# EAGLE schematic Zero_V1.0 (EAGLE 7.7.0)

## Sheet 1 of 3
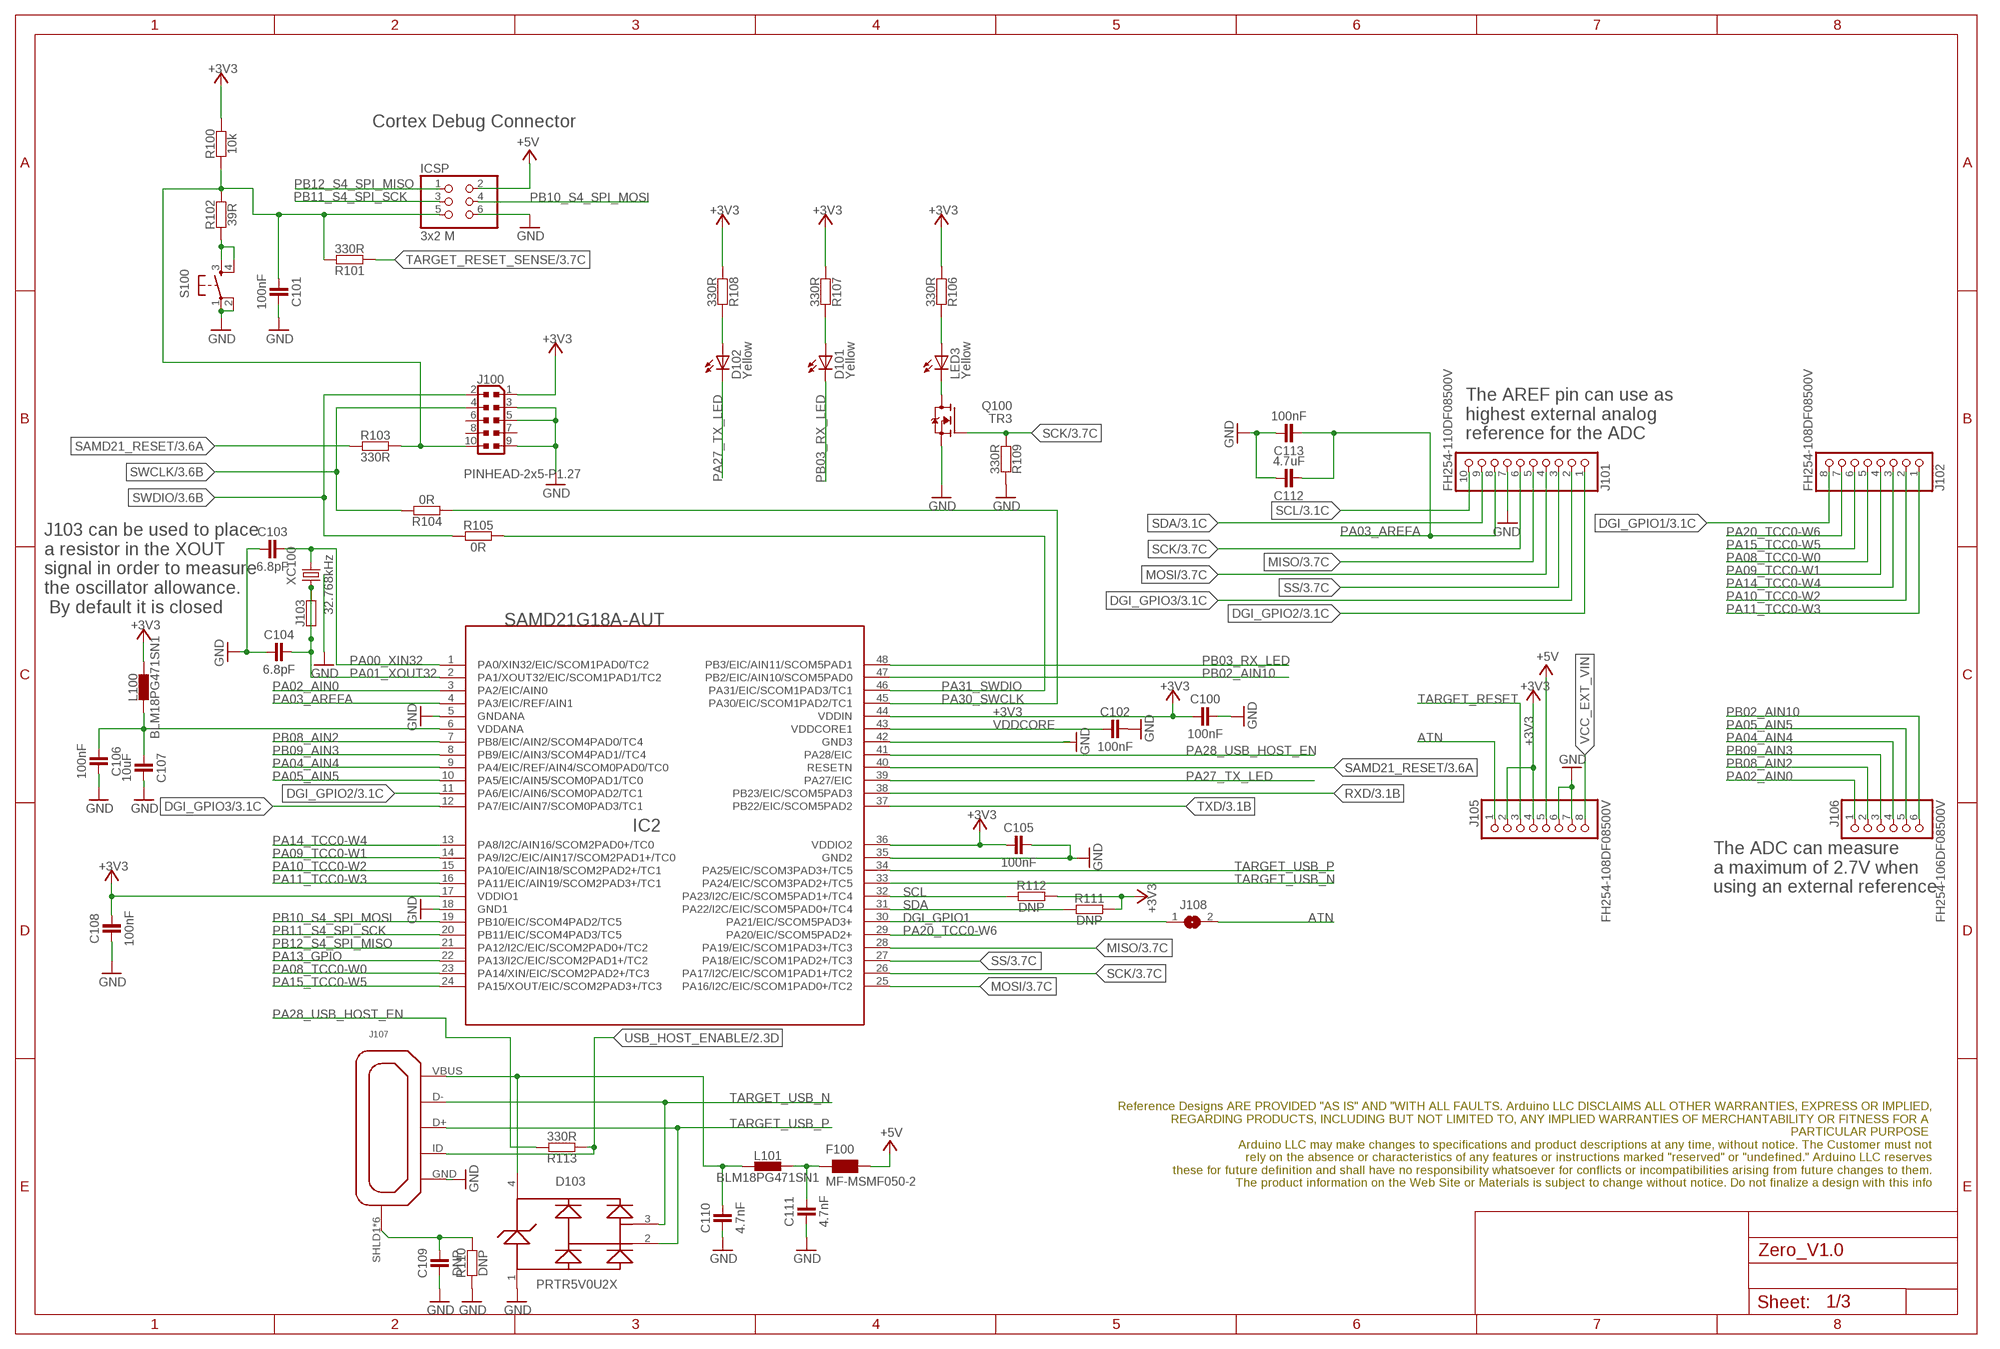
[diagram p0: schematic, sheet 1]

### Parts
C100  100nF  CAPACITORS-0402  [C0402]
C101  100nF  CAPACITORS-0402  [C0402]
C102  100nF  CAPACITORS-0402  [C0402]
C103  6.8pF  CAPACITORS-0402  [C0402]
C104  6.8pF  CAPACITORS-0402  [C0402]
C105  100nF  CAPACITORS-0402  [C0402]
C106  100nF  CAPACITORS-0402  [C0402]
C107  10uF  CAPACITORS-0603  [C0603]
C108  100nF  CAPACITORS-0402  [C0402]
C109  DNP  CAPACITORS-0402  [C0402]
C110  4.7nF  CAPACITORS-0402  [C0402]
C111  4.7nF  CAPACITORS-0402  [C0402]
C112  4.7uF  CAPACITORS-0603  [C0603]
C113  100nF  CAPACITORS-0402  [C0402]
D101  Yellow  0044_KPT-2012YC  [CHIPLED_0805]
D102  Yellow  0044_KPT-2012YC  [CHIPLED_0805]
D103  PRTR5V0U2XB  [SOT143B]
F100  MF-MSMF050-2  WUERTH-ELEKTRONIK_WE-CBF_1812  [WUERTH-ELEKTRONIK_1812]
IC2  SAMD21G18A-AUT  SAMD21G18A  [TQFP48]
ICSP  3x2 M  ICSP  [2X03]
J100  PINHEAD-2x5-P1.27  0171_PH127-205DF055G00AROUND-PADS  [PINHEAD_2X05_127]
J101  FH254-110DF08500V  1684_20TW-537  [1X10]
J102  FH254-108DF08500V  1683_20TW-536  [1X08]
J103  RESISTORS-0402  [C0402]
J105  FH254-108DF08500V  1683_20TW-536  [1X08]
J106  FH254-106DF08500V  1682_20TW-535_STD  [1X06]
J107  ZX62-AB-5PA  [USB-MICRO-10103594]
J108  SJ  [SJ]
L100  BLM18PG471SN1  INDUCTOR-0603  [C0603]
L101  BLM18PG471SN1  INDUCTOR-0603  [C0603]
LED3  Yellow  0044_KPT-2012YC  [CHIPLED_0805]
R100  10k  RESISTORS-0402  [C0402]
R101  330R  RESISTORS-0402  [C0402]
R102  39R  RESISTORS-0402  [C0402]
R103  330R  RESISTORS-0402  [C0402]
R104  0R  RESISTORS-0402  [C0402]
R105  0R  RESISTORS-0402  [C0402]
R106  330R  RESISTORS-0402  [C0402]
R107  330R  RESISTORS-0402  [C0402]
R108  330R  RESISTORS-0402  [C0402]
R109  330R  RESISTORS-0402  [C0402]
R110  DNP  RESISTORS-0402  [C0402]
R111  DNP  RESISTORS-0402  [C0402]
R112  DNP  RESISTORS-0402  [C0402]
R113  330R  RESISTORS-0402  [C0402]
S100  PUSHBUTTON3  [TS42_4PINS]
TR3  Q100  1612_2N7002LT1G  [SOT-23]
U$5  DNP  A3-FRAME-STANDARD  [FRAME]
XC100  32.768kHz  CRYSTALSMD  [CRYSTAL_TC26SMD]

### Nets
+3V3: C100.1 C105.1 C108.2 IC2.17(VDDIO1) IC2.36(VDDIO2) IC2.44(VDDIN) J100.1 J105.2 J105.4 L100.2 R100.2 R106.1 R107.1 R108.1 R111.2 R112.2 ; also sheet 2,3
+5V [usbvcc]: F100.2 ICSP.2 J105.5 ; also sheet 2
ATN: J105.1 J108.2
DGI_GPIO1: IC2.30(PA21/EIC/SCOM5PAD3+) J102.8 J108.1 ; also sheet 3
DGI_GPIO2: IC2.11(PA6/EIC/AIN6/SCOM0PAD2/TC1) J101.1 ; also sheet 3
DGI_GPIO3: IC2.12(PA7/EIC/AIN7/SCOM0PAD3/TC1) J101.2 ; also sheet 3
GND [gnd]: C100.2 C101.2 C102.2 C103.1 C104.1 C105.2 C106.2 C107.2 C108.1 C109.1 C110.1 C111.1 C112.2 C113.2 D103.1 IC2.5(GNDANA) IC2.18(GND1) IC2.35(GND2) IC2.42(GND3) ICSP.6 J100.3 J100.5 J100.9 J101.7 J105.6 J105.7 J107.GND R109.2 R110.1 S100.1 S100.2 TR3.2(S) XC100.P$1(GND) ; also sheet 2,3
MISO: IC2.28(PA19/EIC/SCOM1PAD3+/TC3) J101.5 ; also sheet 3
MOSI: IC2.25(PA16/I2C/EIC/SCOM1PAD0+/TC2) J101.4 ; also sheet 3
N$3: LED3.C TR3.1(D)
N$4: R102.1 S100.3 S100.4
N$7: C110.2 D103.4 J107.VBUS(VUSB) L101.1
N$10: C106.1 C107.1 IC2.6(VDDANA) L100.1
N$11: C109.2 J107.SHLD1(SH) J107.SHLD2(SH) J107.SHLD3(SH) J107.SHLD4(SH) J107.SHLD5(SH) J107.SHLD6(SH) R110.2
N$12: C111.2 F100.1 L101.2
N$20: D102.A R108.2
N$21: D101.A R107.2
N$22: LED3.A R106.2
PA00_XIN32: C103.2 IC2.1(PA0/XIN32/EIC/SCOM1PAD0/TC2) XC100.2
PA01_XOUT32: C104.2 IC2.2(PA1/XOUT32/EIC/SCOM1PAD1/TC2) J103.1 J103.2 XC100.1
PA02_AIN0: IC2.3(PA2/EIC/AIN0) J106.1
PA03_AREFA: C112.1 C113.1 IC2.4(PA3/EIC/REF/AIN1) J101.8
PA04_AIN4: IC2.9(PA4/EIC/REF/AIN4/SCOM0PAD0/TC0) J106.4
PA05_AIN5: IC2.10(PA5/EIC/AIN5/SCOM0PAD1/TC0) J106.5
PA08_TCC0-W0: IC2.23(PA14/XIN/EIC/SCOM2PAD2+/TC3) J102.5
PA09_TCC0-W1: IC2.14(PA9/I2C/EIC/AIN17/SCOM2PAD1+/TC0) J102.4
PA10_TCC0-W2: IC2.15(PA10/EIC/AIN18/SCOM2PAD2+/TC1) J102.2
PA11_TCC0-W3: IC2.16(PA11/EIC/AIN19/SCOM2PAD3+/TC1) J102.1
PA13_GPIO: IC2.22(PA13/I2C/EIC/SCOM2PAD1+/TC2)
PA14_TCC0-W4: IC2.13(PA8/I2C/AIN16/SCOM2PAD0+/TC0) J102.3
PA15_TCC0-W5: IC2.24(PA15/XOUT/EIC/SCOM2PAD3+/TC3) J102.6
PA20_TCC0-W6: IC2.29(PA20/EIC/SCOM5PAD2+) J102.7
PA27_TX_LED: D102.C IC2.39(PA27/EIC)
PA28_USB_HOST_EN: IC2.41(PA28/EIC) R113.2
PA30_SWCLK: IC2.45(PA30/EIC/SCOM1PAD2/TC1) R104.1
PA31_SWDIO: IC2.46(PA31/EIC/SCOM1PAD3/TC1) R105.2
PB02_AIN10: IC2.47(PB2/EIC/AIN10/SCOM5PAD0) J106.6
PB03_RX_LED: D101.C IC2.48(PB3/EIC/AIN11/SCOM5PAD1)
PB08_AIN2: IC2.7(PB8/EIC/AIN2/SCOM4PAD0/TC4) J106.2
PB09_AIN3: IC2.8(PB9/EIC/AIN3/SCOM4PAD1//TC4) J106.3
PB10_S4_SPI_MOSI: IC2.19(PB10/EIC/SCOM4PAD2/TC5) ICSP.4
PB11_S4_SPI_SCK: IC2.20(PB11/EIC/SCOM4PAD3/TC5) ICSP.3
PB12_S4_SPI_MISO: IC2.21(PA12/I2C/EIC/SCOM2PAD0+/TC2) ICSP.1
RXD: IC2.38(PB23/EIC/SCOM5PAD3) ; also sheet 3
SAMD21_RESET: IC2.40(RESETN) R103.1 ; also sheet 3
SCK: IC2.26(PA17/I2C/EIC/SCOM1PAD1+/TC2) J101.6 R109.1 TR3.3(G) ; also sheet 3
SCL: IC2.32(PA23/I2C/EIC/SCOM5PAD1+/TC4) J101.10 R112.1 ; also sheet 3
SDA: IC2.31(PA22/I2C/EIC/SCOM5PAD0+/TC4) J101.9 R111.1 ; also sheet 3
SS: IC2.27(PA18/EIC/SCOM1PAD2+/TC3) J101.3 ; also sheet 3
SWCLK: J100.4 R104.2 ; also sheet 3
SWDIO: J100.2 R105.1 ; also sheet 3
TARGET_RESET: C101.1 ICSP.5 J100.10 J105.3 R100.1 R101.2 R102.2 R103.2
TARGET_RESET_SENSE: R101.1 ; also sheet 3
TARGET_USB_N [USBpair]: D103.3 IC2.33(PA24/EIC/SCOM3PAD2+/TC5) J107.D-
TARGET_USB_P [USBpair]: D103.2 IC2.34(PA25/EIC/SCOM3PAD3+/TC5) J107.D+
TXD: IC2.37(PB22/EIC/SCOM5PAD2) ; also sheet 3
USB_HOST_ENABLE: J107.ID R113.1 ; also sheet 2
VCC_EXT_VIN [USB]: J105.8 ; also sheet 2
VDDCORE: C102.1 IC2.43(VDDCORE1)
Unconnected: J100.6 J100.7 J100.8

### Notes on the sheet
- Cortex Debug Connector
- The AREF pin can use as
  highest external analog
  reference for the ADC
- J103 can be used to place
  a resistor in the XOUT 
  signal in order to measure 
  the oscillator allowance.
   By default it is closed
- The ADC can measure 
  a maximum of 2.7V when
  using an external reference

## Sheet 2 of 3
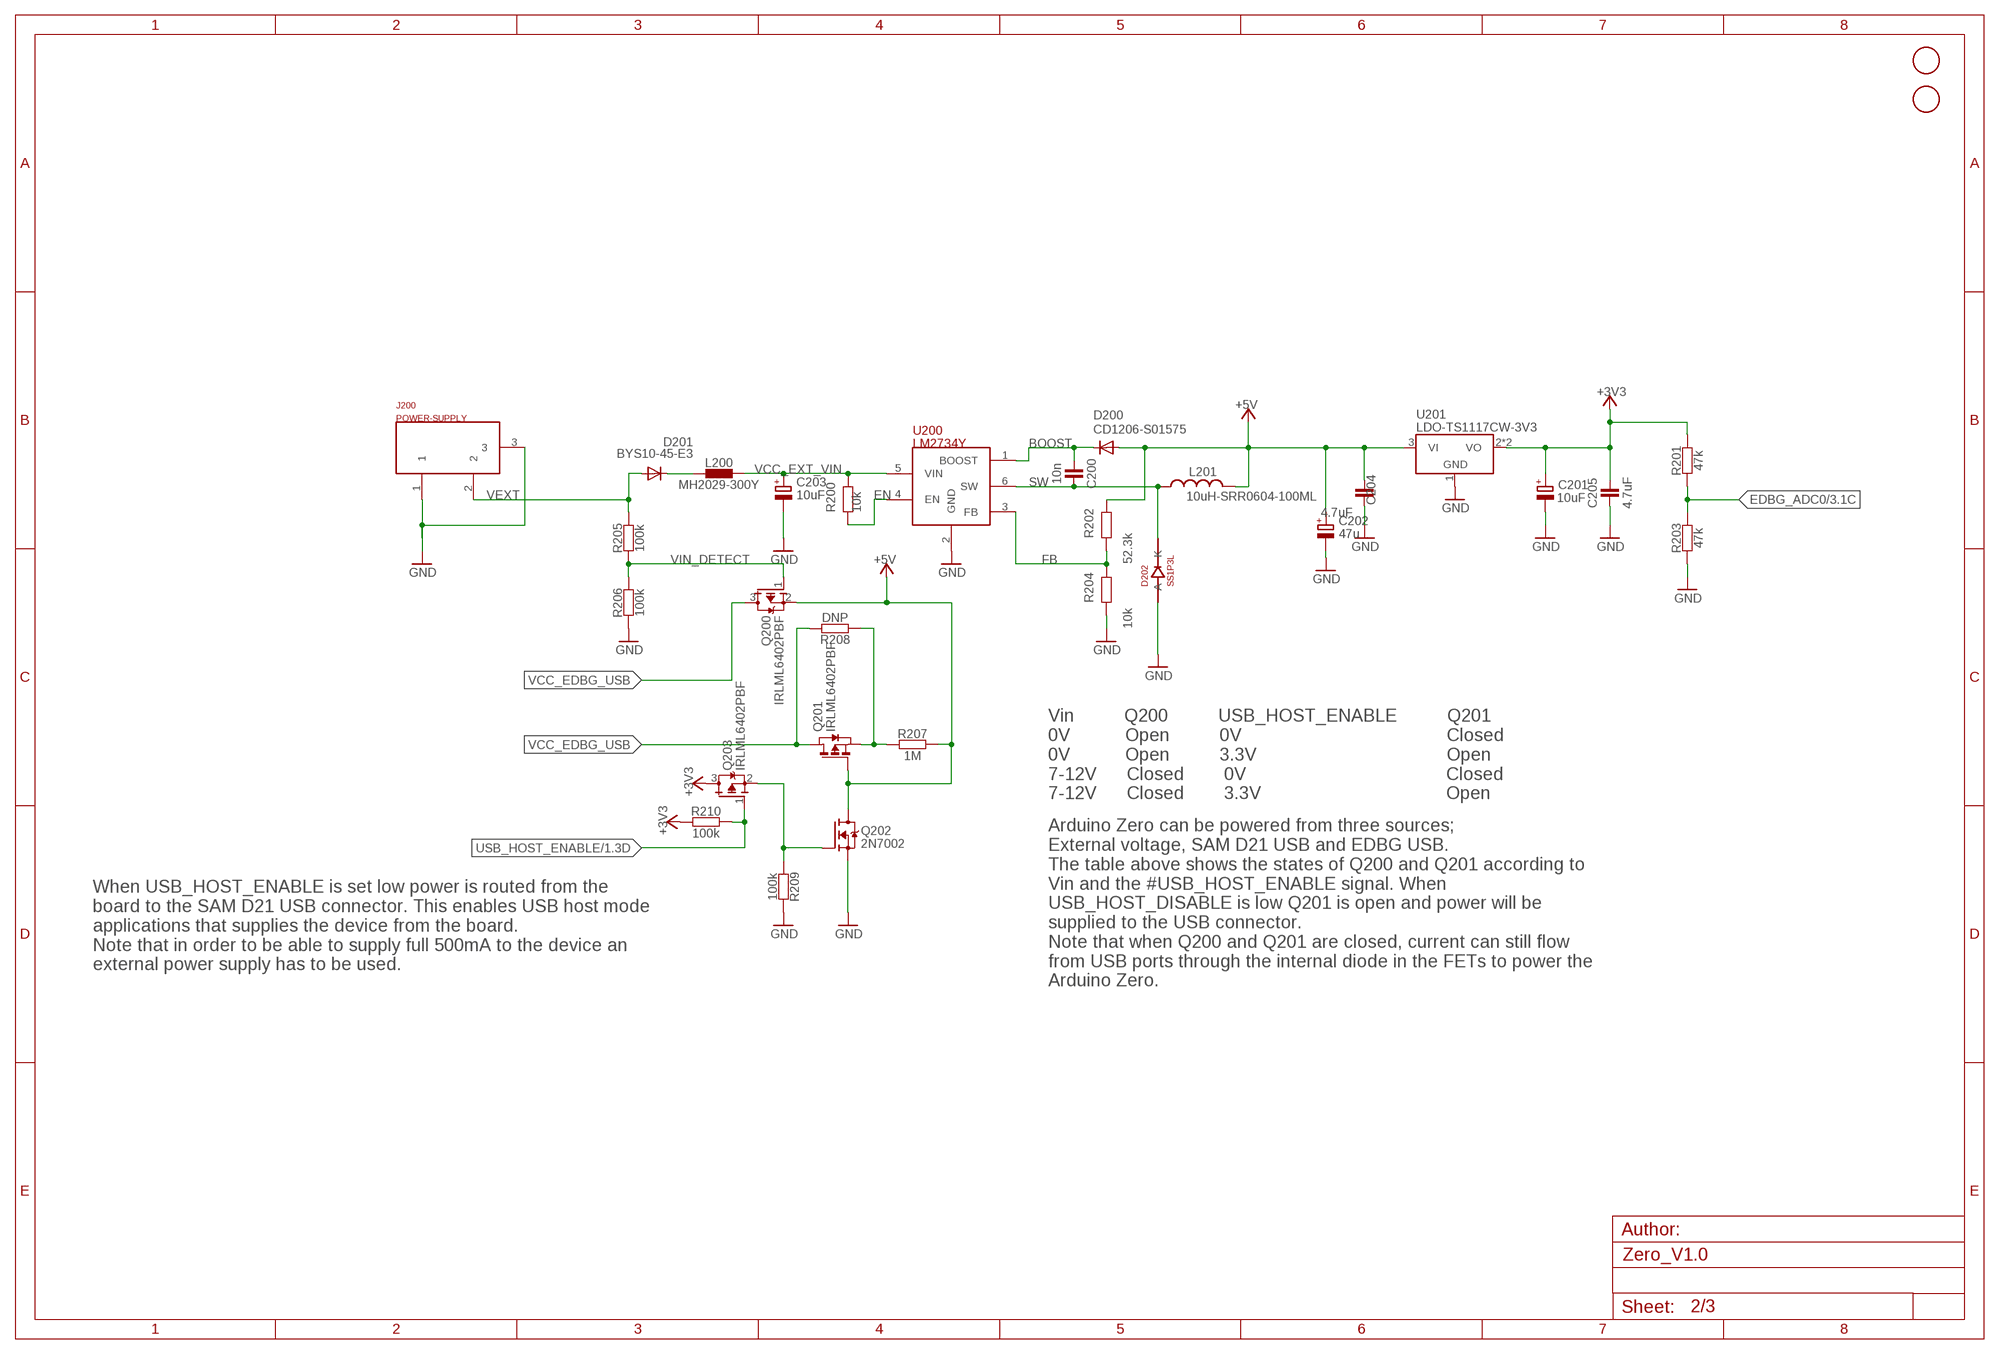
[diagram p1: schematic, sheet 2]

### Parts
C200  10n  CAPACITORS-0402  [C0402]
C201  10uF  0113_47UF  [PANASONIC_D]
C202  47u  0113_47UF  [PANASONIC_D]
C203  10uF  0113_47UF  [PANASONIC_D]
C204  4.7uF  CAPACITORS-0603  [C0603]
C205  4.7uF  CAPACITORS-0603  [C0603]
D200  CD1206-S01575  0012_CD1206-S01575  [MINIMELF]
D201  BYS10-45-E3  0012_CD1206-S01575  [MINIMELF]
D202  SS1P3L  0025_SS1P3L-M3/84A  [DO220AAL]
FD1  FIDUCIALMOUNT  [FIDUCIA-MOUNT]
FD2  FIDUCIALMOUNT  [FIDUCIA-MOUNT]
J200  POWER-SUPPLY  0018_19746-POWER-SUPPLY  [POWERSUPPLY_DC-21MM]
L200  MH2029-300Y  INDUCTOR-0805  [C0805]
L201  10uH-SRR0604-100ML  0031_SRR0604-100ML  [SRR0604]
Q200  IRLML6402PBF  [SOT323]
Q201  IRLML6402PBF  0297_PMV48XP  [SOT-23]
Q202  2N7002  MOSFET-N-SOT23  [SOT23]
Q203  IRLML6402PBF  [SOT323]
R200  10k  RESISTORS-0402  [C0402]
R201  47k  RESISTORS-0402  [C0402]
R202  52.3k  RESISTORS-0402  [C0402]
R203  47k  RESISTORS-0402  [C0402]
R204  10k  RESISTORS-0402  [C0402]
R205  100k  RESISTORS-0402  [C0402]
R206  100k  RESISTORS-0402  [C0402]
R207  1M  RESISTORS-0402  [C0402]
R208  DNP  RESISTORS-0402  [C0402]
R209  100k  RESISTORS-0402  [C0402]
R210  100k  RESISTORS-0402  [C0402]
U200  LM2734Y  0179_LM2734YMK  [SOT23-6]
U201  LDO-TS1117CW-3V3  [SOT223]

### Nets
+3V3: C201.+ C205.2 Q203.3(D) R201.2 R210.1 U201.2(VO) U201.4(VO) ; also sheet 1,3
+5V [usbvcc]: C202.+ C204.1 D200.A L201.P$2 Q200.2(S) Q201.3(G) Q202.3(D) R202.1 R207.2 U201.3(VI) ; also sheet 1
BOOST: C200.1 D200.C U200.1(BOOST)
EDBG_ADC0: R201.1 R203.2 ; also sheet 3
EN: R200.2 U200.4(EN)
FB: R202.2 R204.1 U200.3(FB)
GND [gnd]: C201.- C202.- C203.- C204.2 C205.1 D202.P$2(A) J200.1 J200.3 Q202.2(S) R203.1 R204.2 R206.1 R209.2 U200.2(GND) U201.1(GND) ; also sheet 1,3
N$6: Q201.2(S) R207.1 R208.1
N$8: D201.C L200.1
N$9: Q202.1(G) Q203.2(S) R209.1
SW [USB]: C200.2 D202.P$1(K) L201.P$1 U200.6(SW)
USB_HOST_ENABLE: Q203.1(G) R210.2 ; also sheet 1
VCC_EDBG_USB: Q200.3(D) Q201.1(D) R208.2 ; also sheet 3
VCC_EXT_VIN [USB]: C203.+ L200.2 R200.1 U200.5(VIN) ; also sheet 1
VEXT [USB]: D201.A J200.2 R205.2
VIN_DETECT: Q200.1(G) R205.1 R206.2

### Notes on the sheet
- Vin          Q200          USB_HOST_ENABLE          Q201
  0V           Open          0V                                         Closed
  0V           Open          3.3V                                      Open
  7-12V      Closed        0V                                        Closed
  7-12V      Closed        3.3V                                     Open
- When USB_HOST_ENABLE is set low power is routed from the
  board to the SAM D21 USB connector. This enables USB host mode
  applications that supplies the device from the board.
  Note that in order to be able to supply full 500mA to the device an
  external power supply has to be used.
- Arduino Zero can be powered from three sources;
  External voltage, SAM D21 USB and EDBG USB.
  The table above shows the states of Q200 and Q201 according to
  Vin and the #USB_HOST_ENABLE signal. When
  USB_HOST_DISABLE is low Q201 is open and power will be
  supplied to the USB connector.
  Note that when Q200 and Q201 are closed, current can still flow
  from USB ports through the internal diode in the FETs to power the
  Arduino Zero.

## Sheet 3 of 3
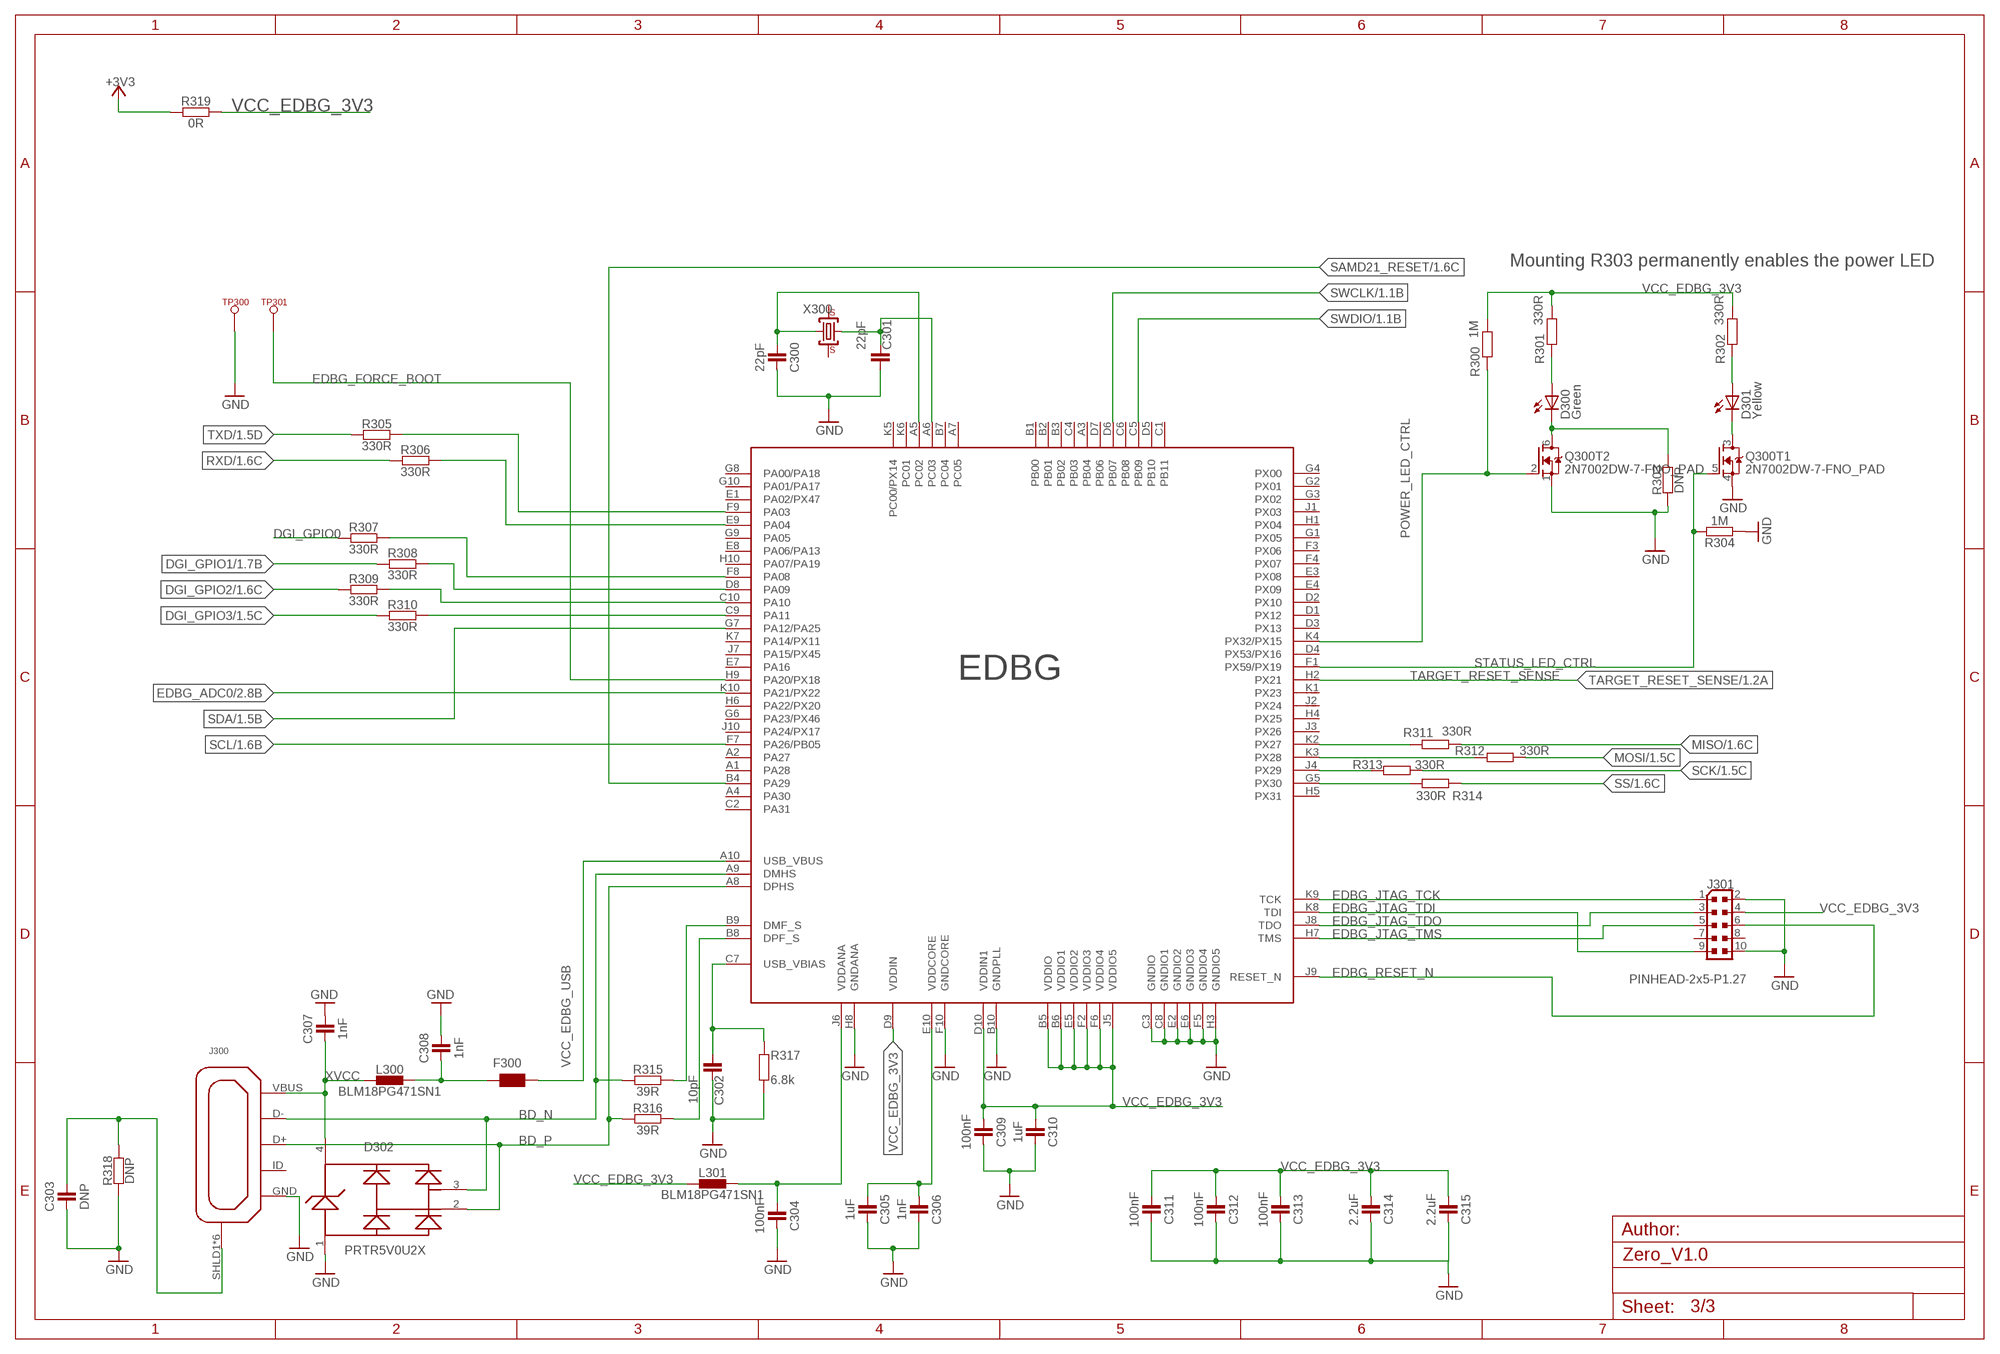
[diagram p2: schematic, sheet 3]

### Parts
C300  22pF  CAPACITORS-0402  [C0402]
C301  22pF  CAPACITORS-0402  [C0402]
C302  10pF  CAPACITORS-0402  [C0402]
C303  DNP  CAPACITORS-0402  [C0402]
C304  100nF  CAPACITORS-0402  [C0402]
C305  1uF  CAPACITORS-0402  [C0402]
C306  1nF  CAPACITORS-0402  [C0402]
C307  1nF  CAPACITORS-0402  [C0402]
C308  1nF  CAPACITORS-0402  [C0402]
C309  100nF  CAPACITORS-0402  [C0402]
C310  1uF  CAPACITORS-0402  [C0402]
C311  100nF  CAPACITORS-0402  [C0402]
C312  100nF  CAPACITORS-0402  [C0402]
C313  100nF  CAPACITORS-0402  [C0402]
C314  2.2uF  CAPACITORS-0402  [C0402]
C315  2.2uF  CAPACITORS-0402  [C0402]
D300  Green  0043_KPT-2012SGC  [CHIPLED_0805]
D301  Yellow  0043_KPT-2012SGC  [CHIPLED_0805]
D302  PRTR5V0U2XB  [SOT143B]
EDBG  EDBG  [VFBGA100]
F300  WUERTH-ELEKTRONIK_WE-CBF_1812  [WUERTH-ELEKTRONIK_1812]
J300  ZX62-AB-5PA  [USB-MICRO-10103594]
J301  PINHEAD-2x5-P1.27  0171_PH127-205DF055G00AROUND-PADS  [PINHEAD_2X05_127]
L300  BLM18PG471SN1  INDUCTOR-0603  [C0603]
L301  BLM18PG471SN1  INDUCTOR-0603  [C0603]
Q300  2N7002DW-7-FNO_PAD  [PWR_SC70-6L2]
R300  1M  RESISTORS-0402  [C0402]
R301  330R  RESISTORS-0402  [C0402]
R302  330R  RESISTORS-0402  [C0402]
R303  DNP  RESISTORS-0402  [C0402]
R304  1M  RESISTORS-0402  [C0402]
R305  330R  RESISTORS-0402  [C0402]
R306  330R  RESISTORS-0402  [C0402]
R307  330R  RESISTORS-0402  [C0402]
R308  330R  RESISTORS-0402  [C0402]
R309  330R  RESISTORS-0402  [C0402]
R310  330R  RESISTORS-0402  [C0402]
R311  330R  RESISTORS-0402  [C0402]
R312  330R  RESISTORS-0402  [C0402]
R313  330R  RESISTORS-0402  [C0402]
R314  330R  RESISTORS-0402  [C0402]
R315  39R  RESISTORS-0402  [C0402]
R316  39R  RESISTORS-0402  [C0402]
R317  6.8k  RESISTORS-0402  [C0402]
R318  DNP  RESISTORS-0402  [C0402]
R319  0R  RESISTORS-0402  [C0402]
TP300  TP_SP  [TP-SP]
TP301  TP_SP  [TP-SP]
X300  12mHz-12pF-K7  12MHZ-12PF-K75.4-3.2  [CRYSTAL-5.4-3.2]

### Nets
+3V3: R319.1 ; also sheet 1,2
BD_N [USBpair]: D302.3 EDBG.A9(DMHS) J300.D- R315.1
BD_P [USBpair]: D302.2 EDBG.A8(DPHS) J300.D+ R316.1
DGI_GPIO0: R307.1
DGI_GPIO1: R308.1 ; also sheet 1
DGI_GPIO2: R309.1 ; also sheet 1
DGI_GPIO3: R310.1 ; also sheet 1
EDBG_ADC0: EDBG.K10(PA21/PX22) ; also sheet 2
EDBG_FORCE_BOOT: EDBG.H9(PA20/PX18) TP301.X(TESTP)
EDBG_JTAG_TCK: EDBG.K9(TCK) J301.1
EDBG_JTAG_TDI: EDBG.K8(TDI) J301.9
EDBG_JTAG_TDO: EDBG.J8(TDO) J301.3
EDBG_JTAG_TMS: EDBG.H7(TMS) J301.5
EDBG_RESET_N: EDBG.J9(RESET_N) J301.6
GND [gnd]: C300.2 C301.2 C302.2 C303.1 C304.2 C305.2 C306.2 C307.2 C308.2 C309.2 C310.2 C311.2 C312.2 C313.2 C314.2 C315.2 D302.1 EDBG.B10(GNDPLL) EDBG.C3(GNDIO) EDBG.C8(GNDIO1) EDBG.E2(GNDIO2) EDBG.E6(GNDIO3) EDBG.F5(GNDIO4) EDBG.F10(GNDCORE) EDBG.H3(GNDIO5) EDBG.H8(GNDANA) J300.GND J301.2 J301.10 Q300.1(T2:S) Q300.4(T1:S) R303.1 R304.1 R317.1 R318.1 TP300.X(TESTP) ; also sheet 1,2
MISO: R311.2 ; also sheet 1
MOSI: R312.2 ; also sheet 1
N$1: D300.C Q300.6(T2:D) R303.2
N$2: D301.C Q300.3(T1:D)
N$5 [gnd]: C303.2 J300.SHLD1(SH) J300.SHLD2(SH) J300.SHLD3(SH) J300.SHLD4(SH) J300.SHLD5(SH) J300.SHLD6(SH) R318.2
N$13: C308.1 F300.1 L300.2
N$18: EDBG.B9(DMF_S) R315.2
N$19: EDBG.B8(DPF_S) R316.2
N$23: C302.1 EDBG.C7(USB_VBIAS) R317.2
N$24: C301.1 EDBG.A6(PC03) X300.1(C1)
N$25: C300.1 EDBG.A5(PC02) X300.3(C2)
N$26: C305.1 C306.1 EDBG.E10(VDDCORE)
N$27: C304.1 EDBG.J6(VDDANA) L301.2
N$34: EDBG.K2(PX27) R311.1
N$37: EDBG.K3(PX28) R312.1
N$38: EDBG.J4(PX29) R313.1
N$39: EDBG.G5(PX30) R314.1
N$40: EDBG.C9(PA11) R310.2
N$41: EDBG.C10(PA10) R309.2
N$42: EDBG.D8(PA09) R308.2
N$43: EDBG.F8(PA08) R307.2
N$44: EDBG.E9(PA04) R306.2
N$45: EDBG.F9(PA03) R305.2
N$67: D300.A R301.1
N$68: D301.A R302.1
POWER_LED_CTRL: EDBG.K4(PX32/PX15) Q300.2(T2:G) R300.1
RXD: R306.1 ; also sheet 1
SAMD21_RESET: EDBG.B4(PA29) ; also sheet 1
SCK: R313.2 ; also sheet 1
SCL: EDBG.F7(PA26/PB05) ; also sheet 1
SDA: EDBG.G7(PA12/PA25) ; also sheet 1
SS: R314.2 ; also sheet 1
STATUS_LED_CTRL: EDBG.F1(PX59/PX19) Q300.5(T1:G) R304.2
SWCLK: EDBG.D6(PB07) ; also sheet 1
SWDIO: EDBG.C5(PB09) ; also sheet 1
TARGET_RESET_SENSE: EDBG.H2(PX21) ; also sheet 1
TXD: R305.1 ; also sheet 1
VCC_EDBG_3V3: C309.1 C310.1 C311.1 C312.1 C313.1 C314.1 C315.1 EDBG.B5(VDDIO) EDBG.B6(VDDIO1) EDBG.D9(VDDIN) EDBG.D10(VDDIN1) EDBG.E5(VDDIO2) EDBG.F2(VDDIO3) EDBG.F6(VDDIO4) EDBG.J5(VDDIO5) J301.4 L301.1 R300.2 R301.2 R302.2 R319.2
VCC_EDBG_USB: EDBG.A10(USB_VBUS) F300.2 ; also sheet 2
XVCC [usbvcc]: C307.1 D302.4 J300.VBUS(VUSB) L300.1
Unconnected: EDBG.A1(PA28) EDBG.A2(PA27) EDBG.A3(PB04) EDBG.A4(PA30) EDBG.A7(PC05) EDBG.B1(PB00) EDBG.B2(PB01) EDBG.B3(PB02) EDBG.B7(PC04) EDBG.C1(PB11) EDBG.C2(PA31) EDBG.C4(PB03) EDBG.C6(PB08) EDBG.D1(PX12) EDBG.D2(PX10) EDBG.D3(PX13) EDBG.D4(PX53/PX16) EDBG.D5(PB10) EDBG.D7(PB06) EDBG.E1(PA02/PX47) EDBG.E3(PX08) EDBG.E4(PX09) EDBG.E7(PA16) EDBG.E8(PA06/PA13) EDBG.F3(PX06) EDBG.F4(PX07) EDBG.G1(PX05) EDBG.G2(PX01) EDBG.G3(PX02) EDBG.G4(PX00) EDBG.G6(PA23/PX46) EDBG.G8(PA00/PA18) EDBG.G9(PA05) EDBG.G10(PA01/PA17) EDBG.H1(PX04) EDBG.H4(PX25) EDBG.H5(PX31) EDBG.H6(PA22/PX20) EDBG.H10(PA07/PA19) EDBG.J1(PX03) EDBG.J2(PX24) EDBG.J3(PX26) EDBG.J7(PA15/PX45) EDBG.J10(PA24/PX17) EDBG.K1(PX23) EDBG.K5(PC00/PX14) EDBG.K6(PC01) EDBG.K7(PA14/PX11) J300.ID J301.7 J301.8 X300.2(GND) X300.4(GND)

### Notes on the sheet
- Mounting R303 permanently enables the power LED

## Library data of the parts
C100-C113 C200 C204 C205 C300-C315 = Arduino:CAPACITORS: Capacitors ...4.7uF @ 6.3V -> 0402 ...10uF @ 16V -> 0603 ...22uF @ 25V -> 0805
C201-C203 = Condensatori:0113_47UF: 47uF; MONTHLY_USAGE: _____; PART_NUMBER: 47uF; PRICE: _____; SUPPLIER: _____; TYPE: Condensatori; VALUE: 47uF
D101 D102 LED3 = Opto:0044_KPT-2012YC: LED YELLOW - SMD - 0805; MONTHLY_USAGE: _____; PART_NUMBER: KPT-2012YC; PRICE: _____; SUPPLIER: _____; TYPE: Opto
D103 D302 = Arduino:PRTR5V0U2X
D200 = Diodi:0012_CD1206-S01575: small-signal high-speed Switching Diodes CD1206; CASE: 1206; MONTHLY_USAGE: _____; PART_NUMBER: CD1206-S01575; PRICE: _____; SUPPLIER: _____; TYPE: Diodi
D201 = Diodi:0012_CD1206-S01575: small-signal high-speed Switching Diodes CD1206; CASE: 1206; MONTHLY_USAGE: _____; PART_NUMBER: CD1206-S01575; PRICE: _____; SUPPLIER: _____; TYPE: Diodi; VALUE: CD1206-S01575
D202 = Diodi:0025_SS1P3L-M3/84A: 1A 30V Schottky Barrier Rectifiers -SS1P3L-M3/84A; CASE: SMP; MONTHLY_USAGE: _____; PART_NUMBER: SS1P3L-M3/84A; PRICE: _____; SUPPLIER: _____; TYPE: Diodi
D300 = Opto:0043_KPT-2012SGC: LED GREEN - SMD-0805; MONTHLY_USAGE: _____; PART_NUMBER: KPT-2012SGC; PRICE: _____; SUPPLIER: _____; TYPE: Opto
D301 = Opto:0043_KPT-2012SGC: LED GREEN - SMD-0805; MONTHLY_USAGE: _____; PART_NUMBER: KPT-2012SGC; PRICE: _____; SUPPLIER: _____; TYPE: Opto; VALUE: Green
EDBG = Arduino:EDBG: ATMEL 32-bit AVR Microcontroller - VFBGA100
F100 F300 = Arduino:WUERTH-ELEKTRONIK_WE-CBF: SMD EMI Suppression Ferrite Beads - excellent anti-EMI properties - low DCR - impedances till 3000 ohms - rated current up to 6 A
FD1 FD2 = Arduino2:FIDUCIALMOUNT
IC2 = Arduino:SAMD21G18A: Atmel D21 32bit ARM Cortex-M0 microcontroller - 48 PIN TQFP 256KB flash memory + 32KB SRAM
ICSP = Arduino:ICSP: PIN HEADER
J100 J301 = Connettori:0171_PH127-205DF055G00A: 2x5 PASSO 1,27
J101 = Connettori:1684_20TW-537: Female Gray Connector strip for Arduino 3V3 bases - 10x1 F V h 8,5 p2,54mm; MONTHLY_USAGE: _____; PART_NUMBER: 20TW-537; PRICE: _____; SUPPLIER: _____; TYPE: Connettori
J102 J105 = Connettori:1683_20TW-536: Female Gray Connector strip for Arduino 3V3 bases - 8x1 F V h 8,5 p2,54mm; MONTHLY_USAGE: _____; PART_NUMBER: 20TW-536; PRICE: _____; SUPPLIER: _____; TYPE: Connettori
J103 R100-R113 R200-R210 R300-R319 = Arduino:RESISTORS: Resistors all kinds in 0603 and 0402
J106 = Connettori:1682_20TW-535: Female Gray Connector strip for Arduino 3V3 bases - 6x1 F V h 8,5 p2,54; MONTHLY_USAGE: 86722.85; PART_NUMBER: 20TW-535; PRICE: _0.03; SUPPLIER: CBC_elettronica__s.r.l.; TYPE: Connettori
J107 J300 = Arduino:ZX62-AB-5PA
J108 = jumper:SJ: SMD solder JUMPER
J200 = Connettori:0018_19746-POWER-SUPPLY: JACK; MONTHLY_USAGE: _____; PART_NUMBER: 19746; PRICE: _____; SUPPLIER: _____; TYPE: Connettori
L100 L101 L200 L300 L301 = Arduino:INDUCTOR: Inductors
L201 = Induttanze:0031_SRR0604-100ML: SRR0604-100ML; CASE: SMD_6,5x6,5; MONTHLY_USAGE: _____; PART_NUMBER: SRR0604-100ML; PRICE: _____; SUPPLIER: _____; TYPE: Induttanze
Q200 Q203 = Arduino:IRLML6402PBF
Q201 = Transistors:0297_PMV48XP: 20 V, 3.5 A P-channel Trench MOSFET - PMV48XP; CASE: SOT23; MONTHLY_USAGE: _____; PART_NUMBER: PMV48XP; PRICE: _____; SUPPLIER: _____; TYPE: Transistor; VALUE: PMV48XP
Q202 = we-transistor:MOSFET-N: N-Channel MOSFET (e.g. IRLML2502, BSS138)
Q300 = Arduino:2N7002DW-7-F: BSS138 Dual N-Channel MOSFET (UGS +/-20V, RDS 1Ohm, ID 320mA)
S100 = Arduino:PUSHBUTTON3: TS42 Dongnan Electronics Tact switch VDC 12V - 50mA
TP300 TP301 = Arduino2:TP_SP
TR3 = Transistors:1612_2N7002LT1G: 2N7002 60 V, 300 mA N-channel Trench MOSFET; VALUE: 2N7002
U200 = Circuito Integrato:0179_LM2734YMK: 1A Load Step-Down DC-DC Regulator - LM2734Y Switching; CASE: SOT23-5; MONTHLY_USAGE: _____; PART_NUMBER: LM2734YMK; PRICE: _____; SUPPLIER: _____; TYPE: Circuito_Integrato; VALUE: LM2734YMK
U201 = we-power:LDO: LDOs TS1117 800mA max 15V - compatible NCP1117 1A max 20V TS9011 250mA max 12V - compatible AP2210 300mA max 15V TS5204 150mA max 16V
U$5 = Arduino-utility:A3-FRAME: Schematic frame; DATASHEET: DNP; DISTRIBUTOR-LINK: DNP; DISTRIBUTOR-PN: DNP; MANUFACTURER: DNP; MANUFACTURER-PN: DNP
X300 = Arduino:12MHZ-12PF-K7: 12Mhz - K7 12pF - SMD
XC100 = Arduino:CRYSTAL: Crystals

## Net classes
0 default: width 0.102 mm, drill 0.1 mm
1 USB: width 0.102 mm, drill 0.1 mm
2 gnd: width 0.102 mm, drill 0.1 mm
3 usbvcc: width 0.102 mm, drill 0.1 mm, clearance 0.15 mm
4 USBpair: width 0.102 mm, drill 0.1 mm, clearance 0.15 mm to class 3